# EAGLE design ADNS-9800 (EAGLE 8.2.1)
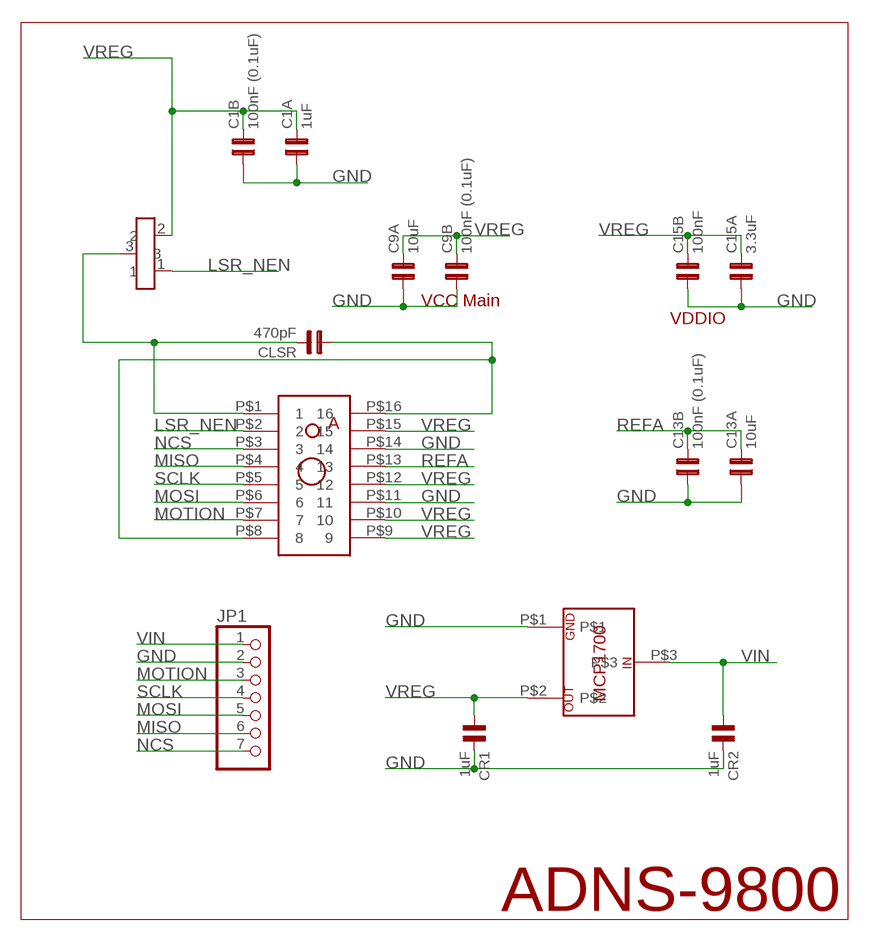
[diagram p0: schematic, sheet 1]

## Parts
C1A  1uF  C0603  [0603]
C1B  100nF (0.1uF)  C0603  [0603]
C9A  10uF  C0603  [0603]
C9B  100nF (0.1uF)  C0603  [0603]
C13A  10uF  C0603  [0603]
C13B  100nF (0.1uF)  C0603  [0603]
C15A  3.3uF  C0603  [0603]
C15B  100nF  C0603  [0603]
CLSR  470pF  C0603  [0603]
CR1  1uF  C0603  [0603]
CR2  1uF  C0603  [0603]
JP1  PINHD-1X7  [1X07]
Q1  TRANSISTOR_SC-75  [SC-75_TRANSISTOR]
U$1  AVAGO_ADNS-9500  [AVAGO_ADNS-9500]
U$2  MCP1700__LDO  [MCP1700__LDO]

## Nets
CM: CLSR.2 Q1.3 U$1.P$1
GND: C1A.1 C1B.1 C9A.1 C9B.1 C13A.1 C13B.1 C15A.1 C15B.1 CR1.2 CR2.2 JP1.2 U$1.P$11 U$1.P$14 U$2.P$1
LSR_NEN: Q1.1 U$1.P$2
MISO: JP1.6 U$1.P$4
MOSI: JP1.5 U$1.P$6
MOTION: JP1.3 U$1.P$7
N$1: CLSR.1 U$1.P$8 U$1.P$16
NCS: JP1.7 U$1.P$3
REFA: C13A.2 C13B.2 U$1.P$13
SCLK: JP1.4 U$1.P$5
VIN: CR2.1 JP1.1 U$2.P$3
VREG: C1A.2 C1B.2 C9A.2 C9B.2 C15A.2 C15B.2 CR1.1 Q1.2 U$1.P$9 U$1.P$10 U$1.P$12 U$1.P$15 U$2.P$2

## Notes on the sheet
- VCC Main
- VDDIO
- ADNS-9800

## Library data of the parts
C1A C1B C9A C9B C13A C13B C15A C15B CLSR CR1 CR2 = capsmd:C0603
JP1 = pinhead:PINHD-1X7: PIN HEADER
Q1 = JKCustom:TRANSISTOR_SC-75: SC-75 Package
U$1 = JKCustom:AVAGO_ADNS-9500
U$2 = JKCustom:MCP1700__LDO

## Net classes
0 default: width 0.406 mm, clearance 0.203 mm

## Board
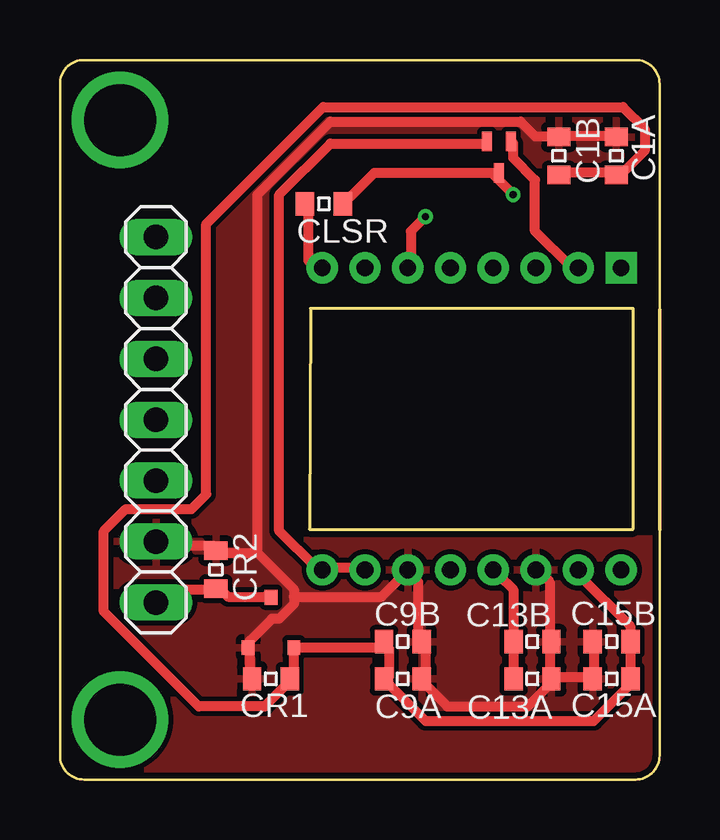
[diagram p1: board, top side]
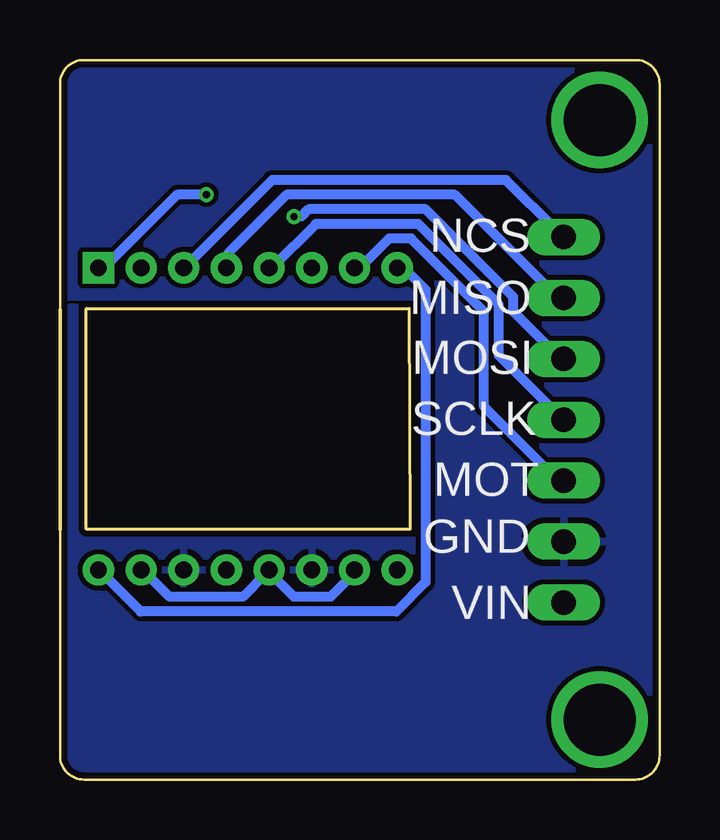
[diagram p2: board, bottom side, seen from below]

Size 25 x 30 mm. Coordinates in mm from the lower left corner, seen from the top.
Outline: 24,0 1,0 arc-90 0,1 0,29 arc-90 1,30 24,30 arc-90 25,29 25,1 arc-90 24,0
Copper layers (1*16): Top 0.035mm / dielectric 1.5mm / Bottom 0.035mm
Design rules "SeeedStudio_2layer_DRU_no_angle_20140221": minimum track width 6mil, minimum drill 12mil, track to track 6mil, track to pad 6mil, pad to pad 6mil, via to via 6mil, smd to smd 0mil, copper to edge 10mil, drill to drill 10mil, minimum pad ring 10mil, minimum via ring 6mil, stop-mask expansion 2mil, vias tented up to drill 100mil, thermal gap 10mil
tRestrict: area 10.4,10.2 to 25.1,19.9
bRestrict: 3 lines
Milling: 1 lines

### Footprints (pad centres in the part's own frame; a part is rotated, then mirrored left to right if it is on the bottom)
0603 = smd 0.762 x 0.965: 1 -0.787,0; 2 0.787,0
1X07 = drill 1.016 long: 1 -7.62,0; 2 -5.08,0; 3 -2.54,0; 4 0,0; 5 2.54,0; 6 5.08,0; 7 7.62,0
SC-75_TRANSISTOR = smd 0.406 x 0.813: 1 0.2,0.4; 2 1.2,0.4; 3 0.7,1.7
AVAGO_ADNS-9500 = drill 0.7 pad 1.3 square: P$1 0,0 | drill 0.7 pad 1.3: P$2 -1.78,0; P$3 -3.56,0; P$4 -5.34,0; P$5 -7.12,0; P$6 -8.9,0; P$7 -10.68,0; P$8 -12.46,0; P$9 -12.46,-12.6; P$10 -10.68,-12.6; P$11 -8.9,-12.6; P$12 -7.12,-12.6; P$13 -5.34,-12.6; P$14 -3.56,-12.6; P$15 -1.78,-12.6; P$16 0,-12.6
MCP1700__LDO = smd 0.54 x 0.62: P$1 0,0; P$2 1.9,0; P$3 0.95,2.1

### Placement (x,y rotation side)
C1A  23.2,26 270 top
C1B  20.8,26 270 top
C9A  14.3,4.2 180 top
C9B  14.3,5.75 180 top
C13A  19.7,4.2 180 top
C13B  19.7,5.75 180 top
C15A  23,4.2 0 top
C15B  23,5.75 0 top
CLSR  11,24 0 top
CR1  8.8,4.2 180 top
CR2  6.5,8.75 90 top
JP1  4,15 90 top
Q1  19,27 180 top
U$1  23.4,21.34 0 top
U$2  7.85,5.5 0 top

### Tracks (layer width: path | path; a pad name or v marks a point on that pad's centre or on a via)
CM  (via drill 0.3)
  Top 0.406: 17.98,25.3 13.11,25.3 11.89,24.08 CLSR.2 | 17.98,25.3 18.29,25.3 Q1.3 | 17.98,25.3 v18.9,24.38
  Bottom 0.406: v18.9,24.38 20.12,24.38 23.16,21.34 U$1.P$1
GND
  Top 0.406: C13A.1 20.42,4.27 20.42,5.49 C13B.1 20.42,5.79 20.42,8.23 20.12,8.53 U$1.P$14 | C15B.1 22.25,5.49 22.25,4.27 C15A.1 21.95,4.27 20.73,4.27 C13A.1 | C1A.1 23.16,26.82 21.03,26.82 C1B.1 20.73,26.82 19.81,26.82 19.2,27.43 11.28,27.43 8.23,24.38 8.23,9.45 | CR1.2 7.92,4.27 7.92,5.49 U$2.P$1 7.92,5.79 8.84,6.71 9.14,6.71 9.75,7.32 9.75,7.62 | JP1.2 4.27,9.75 6.4,9.75 CR2.2 6.71,9.45 8.23,9.45 | 9.75,7.62 9.75,7.92 8.23,9.45 | 9.75,7.62 13.41,7.62 14.33,8.53 U$1.P$11 14.63,8.53 14.94,8.23 14.94,5.79 C9B.1 15.24,5.49 15.24,4.27 C9A.1 15.24,3.96 16.15,3.05 19.51,3.05 20.42,3.96 C13A.1
  pour Bottom: 33.6,-1.3 33.4,30.92 -1.48,30.62 -1.28,-1.6
  pour Top: 27.4,-0.4 27.3,30.62 -10.58,30.22 -10.48,-0.8
LSR_NEN
  Top 0.406: Q1.1 18.9,26.52 18.9,25.91 19.81,24.99 19.81,22.86 21.34,21.34 U$1.P$2
MISO
  Bottom 0.406: U$1.P$4 17.98,21.34 17.98,21.95 15.54,24.38 8.53,24.38 4.27,20.12 JP1.6
MOSI  (via drill 0.3)
  Top 0.406: v15.24,23.47 14.63,22.86 14.63,21.34 U$1.P$6
  Bottom 0.406: v15.24,23.47 14.94,23.47 14.63,23.77 9.75,23.77 6.1,20.12 6.1,19.51 4.27,17.68 JP1.5
MOTION
  Bottom 0.406: U$1.P$7 12.5,21.34 11.28,22.55 10.36,22.55 7.32,19.51 7.32,15.54 4.27,12.5 JP1.3
N$1
  Top 0.406: CLSR.1 10.36,23.77 10.36,21.64 10.67,21.34 U$1.P$8
  Bottom 0.406: U$1.P$16 23.16,8.53 21.64,7.01 10.97,7.01 9.75,8.23 9.75,20.42 10.67,21.34 U$1.P$8
N$5  (via drill 3 pad 3.81)
  other vias: 2.5,27.5
N$6  (via drill 3 pad 3.81)
  other vias: 2.5,2.5
NCS
  Bottom 0.406: U$1.P$3 19.81,21.34 16.15,24.99 6.4,24.99 4.27,22.86 JP1.7
REFA
  Top 0.406: C13A.2 18.9,4.27 18.9,5.49 C13B.2 18.9,5.79 18.9,7.92 18.29,8.53 U$1.P$13
SCLK
  Bottom 0.406: U$1.P$5 16.15,21.34 14.33,23.16 10.06,23.16 6.71,19.81 6.71,17.68 4.27,15.24 JP1.4
VIN
  Top 0.406: U$2.P$3 8.53,7.62 7.01,7.62 6.71,7.92 CR2.1 6.4,7.92 4.57,7.92 4.27,7.62 JP1.1
VREG
  Top 0.406: U$1.P$15 21.64,8.53 23.77,6.4 23.77,5.79 C15B.2 23.77,5.49 23.77,4.27 C15A.2 23.77,3.96 22.25,2.44 15.24,2.44 13.72,3.96 C9A.2 13.72,4.27 13.72,5.49 C9B.2 13.41,5.49 9.75,5.49 | Q1.2 17.68,26.52 11.28,26.52 9.14,24.38 9.14,10.36 10.67,8.84 U$1.P$9 10.97,8.84 12.5,8.84 U$1.P$10 | C1B.2 21.03,25.3 23.16,25.3 C1A.2 23.47,25.3 24.38,26.21 24.38,27.13 23.47,28.04 10.97,28.04 6.1,23.16 6.1,11.89 5.49,11.28 2.74,11.28 1.83,10.36 1.83,7.01 5.79,3.05 8.53,3.05 9.45,3.96 CR1.1 9.75,4.27 9.75,5.49 | 9.75,5.49 U$2.P$2
  Bottom 0.406: U$1.P$10 12.8,8.53 13.72,7.62 15.24,7.62 16.15,8.53 U$1.P$12 16.46,8.53 17.37,7.62 20.42,7.62 21.34,8.53 U$1.P$15

### Text on the board
bNames: NCS | MISO | MOSI | SCLK | MOT | GND | VIN